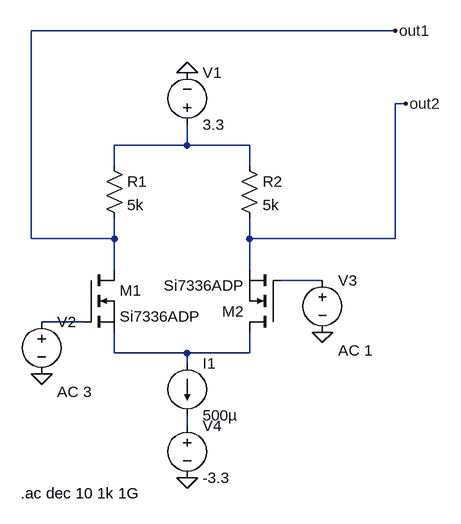
[diagram p0: schematic Differential_Amplifier.asc]
Differential_Amplifier.asc, the LTspice schematic file:
Version 4
SHEET 1 880 680
WIRE 560 -192 0 -192
WIRE 576 -80 560 -80
WIRE 240 -16 240 -48
WIRE 240 -16 128 -16
WIRE 336 -16 240 -16
WIRE 128 16 128 -16
WIRE 336 16 336 -16
WIRE 0 128 0 -192
WIRE 128 128 128 96
WIRE 128 128 0 128
WIRE 336 128 336 96
WIRE 560 128 560 -80
WIRE 560 128 336 128
WIRE 128 176 128 128
WIRE 336 176 336 128
WIRE 448 192 384 192
WIRE 80 256 16 256
WIRE 128 304 128 272
WIRE 240 304 128 304
WIRE 336 304 336 272
WIRE 336 304 240 304
WIRE 240 320 240 304
WIRE 240 416 240 400
FLAG 240 -128 0
FLAG 16 336 0
FLAG 448 272 0
FLAG 240 496 0
FLAG 560 -192 out1
FLAG 576 -80 out2
SYMBOL nmos 80 176 R0
SYMATTR InstName M1
SYMATTR Value Si7336ADP
SYMBOL nmos 384 272 R180
SYMATTR InstName M2
SYMATTR Value Si7336ADP
SYMBOL current 240 320 R0
WINDOW 123 0 0 Left 0
WINDOW 39 0 0 Left 0
SYMATTR InstName I1
SYMATTR Value 500µ
SYMBOL res 112 0 R0
SYMATTR InstName R1
SYMATTR Value 5k
SYMBOL res 320 0 R0
SYMATTR InstName R2
SYMATTR Value 5k
SYMBOL voltage 240 -32 M180
WINDOW 0 24 96 Left 2
WINDOW 3 24 16 Left 2
WINDOW 123 0 0 Left 0
WINDOW 39 0 0 Left 0
SYMATTR InstName V1
SYMATTR Value 3.3
SYMBOL voltage 16 240 R0
WINDOW 123 24 124 Left 2
WINDOW 39 0 0 Left 0
SYMATTR Value2 AC 3
SYMATTR InstName V2
SYMATTR Value ""
SYMBOL voltage 448 176 R0
WINDOW 123 24 124 Left 2
WINDOW 39 0 0 Left 0
SYMATTR Value2 AC 1
SYMATTR InstName V3
SYMATTR Value ""
SYMBOL voltage 240 400 R0
WINDOW 123 0 0 Left 0
WINDOW 39 0 0 Left 0
SYMATTR InstName V4
SYMATTR Value -3.3
TEXT -16 520 Left 2 !.ac dec 10 1k 1G

The netlist it stands for:
* Differential_Amplifier.asc
M1 out1 N003 N004 N004 Si7336ADP
M2 N004 N002 out2 out2 Si7336ADP
I1 N004 N005 500µ
R1 N001 out1 5k
R2 N001 out2 5k
V1 N001 0 3.3
V2 N003 0 AC 3
V3 N002 0 AC 1
V4 N005 0 -3.3
.model NMOS NMOS
.model PMOS PMOS
.lib standard.mos
.ac dec 10 1k 1G
.backanno
.end